# EAGLE design draft2 (EAGLE 7.6.0)

## Sheet 1 of 2
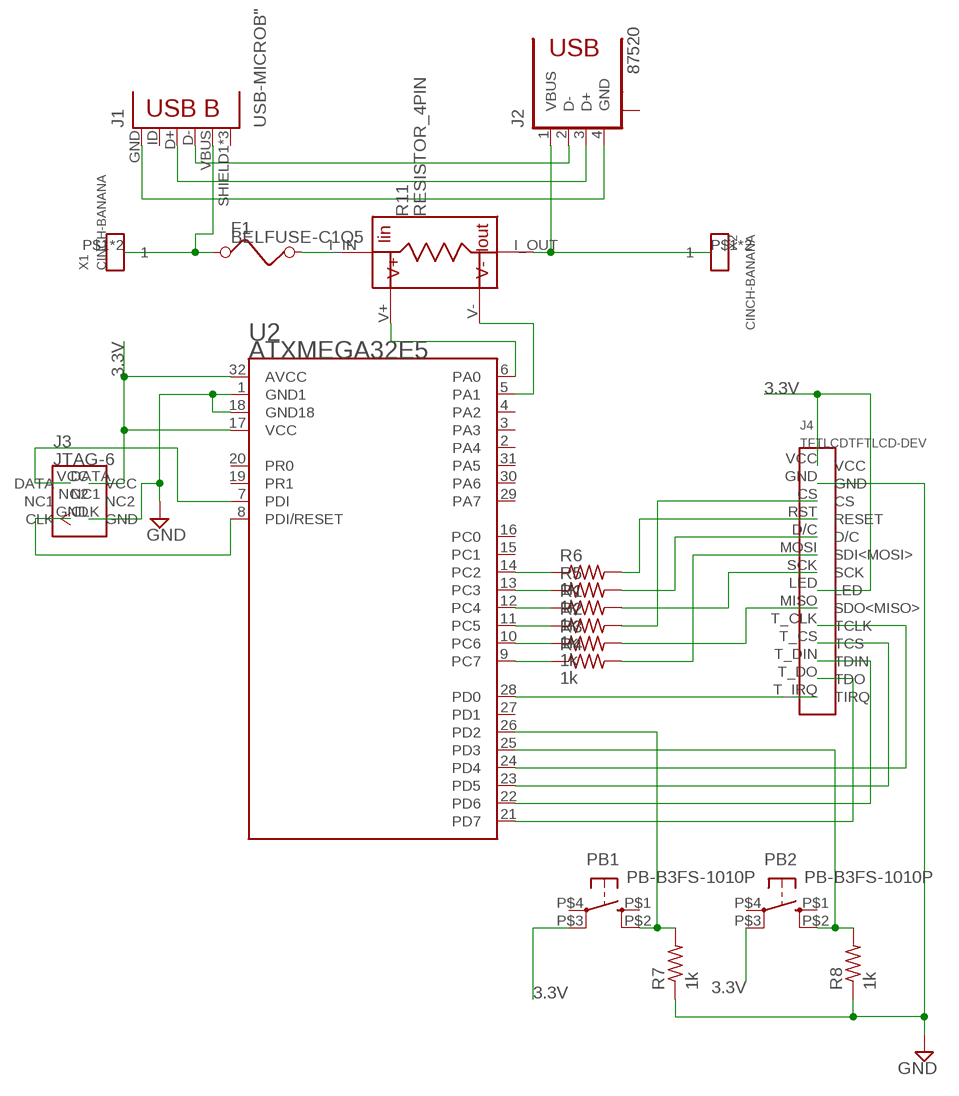
[diagram p0: schematic, sheet 1]

### Parts
ATXMEGA32E5  U2  ATXMEGA32E5/16E5/8E5ATXMEGA32E5-AU  [TQFP32-08]
F1  BELFUSE-C1Q5  [BELFUSE-C1Q5]
J1  USB-MICROB"  [USB-B-MICRO-SMD_V03]
J2  87520  [87520]
J3  JTAG-6  [JTAG6]
J4  TFTLCDTFTLCD-DEV  [TFTLCD]
PB1  PB-B3FS-1010P  [PB-B3FS-1010P]
PB2  PB-B3FS-1010P  [PB-B3FS-1010P]
R1  1k  R-RC1206  [RC1206]
R2  1k  R-RC1206  [RC1206]
R3  1k  R-RC1206  [RC1206]
R4  1k  R-RC1206  [RC1206]
R5  1k  R-RC1206  [RC1206]
R6  1k  R-RC1206  [RC1206]
R7  1k  R-RC1206  [RC1206]
R8  1k  R-RC1206  [RC1206]
R11  RESISTOR_4PIN  [RESISTOR_4PIN]
X1  CINCH-BANANA  [CINCH-BANANA]
X2  CINCH-BANANA  [CINCH-BANANA]

### Nets
3.3V: ATXMEGA32E5.17(VCC) ATXMEGA32E5.32(AVCC) J3.VCC J4.LED J4.VCC PB1.P$3(SW3) PB2.P$3(SW3) ; also sheet 2
GND: ATXMEGA32E5.1(GND1) ATXMEGA32E5.18(GND18) J3.GND J4.GND R7.P$1 R8.P$1 ; also sheet 2
N$1: ATXMEGA32E5.7(PDI) J3.DATA
N$2: ATXMEGA32E5.8(PDI/RESET) J3.CLK
N$3: ATXMEGA32E5.9(PC7) R4.P$1
N$4: ATXMEGA32E5.10(PC6) R3.P$1
N$5: ATXMEGA32E5.11(PC5) R2.P$1
N$6: ATXMEGA32E5.12(PC4) R1.P$1
N$7: J4.MOSI(SDI<MOSI>) R4.P$2
N$8: J4.MISO(SDO<MISO>) R3.P$2
N$9: J4.SCK R1.P$2
N$10: J4.CS R2.P$2
N$11: ATXMEGA32E5.14(PC2) R6.P$1
N$12: J4.RST(RESET) R6.P$2
N$13: ATXMEGA32E5.13(PC3) R5.P$1
N$14: J4.D/C R5.P$2
N$15: ATXMEGA32E5.28(PD0) J4.T_IRQ(TIRQ)
N$16: ATXMEGA32E5.21(PD7) J4.T_DO(TDO)
N$17: ATXMEGA32E5.22(PD6) J4.T_DIN(TDIN)
N$18: ATXMEGA32E5.23(PD5) J4.T_CS(TCS)
N$19: ATXMEGA32E5.24(PD4) J4.T_CLK(TCLK)
N$20: ATXMEGA32E5.26(PD2) PB1.P$2(SW2) R7.P$2
N$21: ATXMEGA32E5.25(PD3) PB2.P$2(SW2) R8.P$2
N$22: ATXMEGA32E5.6(PA0) R11.V+
N$23: ATXMEGA32E5.5(PA1) R11.V-
N$24: F1.P$1 J1.VBUS X1.P$1 X1.P$2
N$25: F1.P$2 R11.I_IN
N$26: J1.GND J2.4(GND)
N$28: J1.D+ J2.3(D+)
N$29: J1.D- J2.2(D-)
N$30: J2.1(VBUS) R11.I_OUT X2.P$1 X2.P$2
Unconnected: ATXMEGA32E5.2(PA4) ATXMEGA32E5.3(PA3) ATXMEGA32E5.4(PA2) ATXMEGA32E5.15(PC1) ATXMEGA32E5.16(PC0) ATXMEGA32E5.19(PR1) ATXMEGA32E5.20(PR0) ATXMEGA32E5.27(PD1) ATXMEGA32E5.29(PA7) ATXMEGA32E5.30(PA6) ATXMEGA32E5.31(PA5) J1.ID(USBID) J1.SHIELD1(SHIELD) J1.SHIELD2(SHIELD) J1.SHIELD3(SHIELD) J2.S1 J2.S2 J3.NC1 J3.NC2 PB1.P$1(SW1) PB1.P$4(SW4) PB2.P$1(SW1) PB2.P$4(SW4)

## Sheet 2 of 2
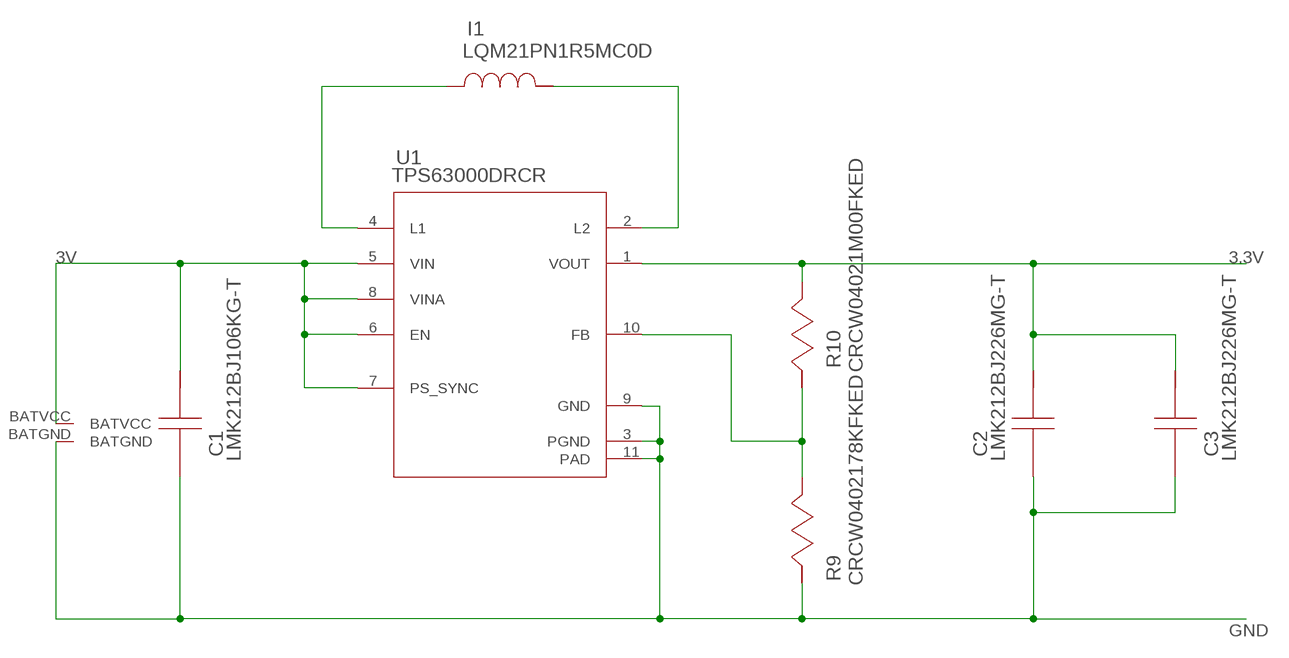
[diagram p1: schematic, sheet 2]

### Parts
C1  LMK212BJ106KG-T  [0805]
C2  LMK212BJ226MG-T  [0805]
C3  LMK212BJ226MG-T  [0805]
I1  LQM21PN1R5MC0D  [0805]
R9  CRCW0402178KFKED  [0402]
R10  CRCW04021M00FKED  [0402]
U1  TPS63000DRCR  [DRC0010J]
U$12  BATTERYHOLDER  [BATTERYHOLDER]

### Nets
3.3V: C2.1 C3.1 R10.1 U1.1(VOUT) ; also sheet 1
3V: C1.1 U1.5(VIN) U1.6(EN) U1.7(PS_SYNC) U1.8(VINA) U$12.BATVCC
GND: C1.2 C2.2 C3.2 R9.2 U1.3(PGND) U1.9(GND) U1.11(PAD) U$12.BATGND ; also sheet 1
N$31: I1.1 U1.4(L1)
N$32: I1.2 U1.2(L2)
N$34: R9.1 R10.2 U1.10(FB)

## Library data of the parts
ATXMEGA32E5 = ese323:ATXMEGA32E5/16E5/8E5: 8/16-bit Atmel AVR XMEGA Microcontrollers
C1 = 00ese323:LMK212BJ106KG-T; MANUFACTURER_NAME: Taiyo Yuden; VENDOR: Taiyo Yuden
C2 C3 = 00ese323:LMK212BJ226MG-T; MANUFACTURER_NAME: Taiyo Yuden; VENDOR: Taiyo Yuden
F1 = 00ese323:BELFUSE-C1Q5
I1 = 00ese323:LQM21PN1R5MC0D; MANUFACTURER_NAME: MuRata; VENDOR: MuRata
J1 = 00ese323:USB-MICROB; PROD_ID: CONN-11752
J2 = 00ese323:87520: TYPE-A Receptacle, FCI
J3 = 00ese323:JTAG-6
J4 = 00ese323:TFTLCD
PB1 PB2 = 00ese323:PB-B3FS-1010P
R1-R8 = 00ese323:R-RC1206
R9 = 00ese323:CRCW0402178KFKED; MANUFACTURER_NAME: Vishay-Dale; VENDOR: Vishay-Dale
R10 = 00ese323:CRCW04021M00FKED; MANUFACTURER_NAME: Vishay-Dale; VENDOR: Vishay-Dale
R11 = 00ese323:RESISTOR_4PIN
U1 = 00ese323:TPS63000DRCR; MANUFACTURER_NAME: Texas Instruments; MANUFACTURER_PART_NUMBER: TPS63000DRCR
U$12 = 00ese323:BATTERYHOLDER
X1 X2 = 00ese323:CINCH-BANANA

## Board
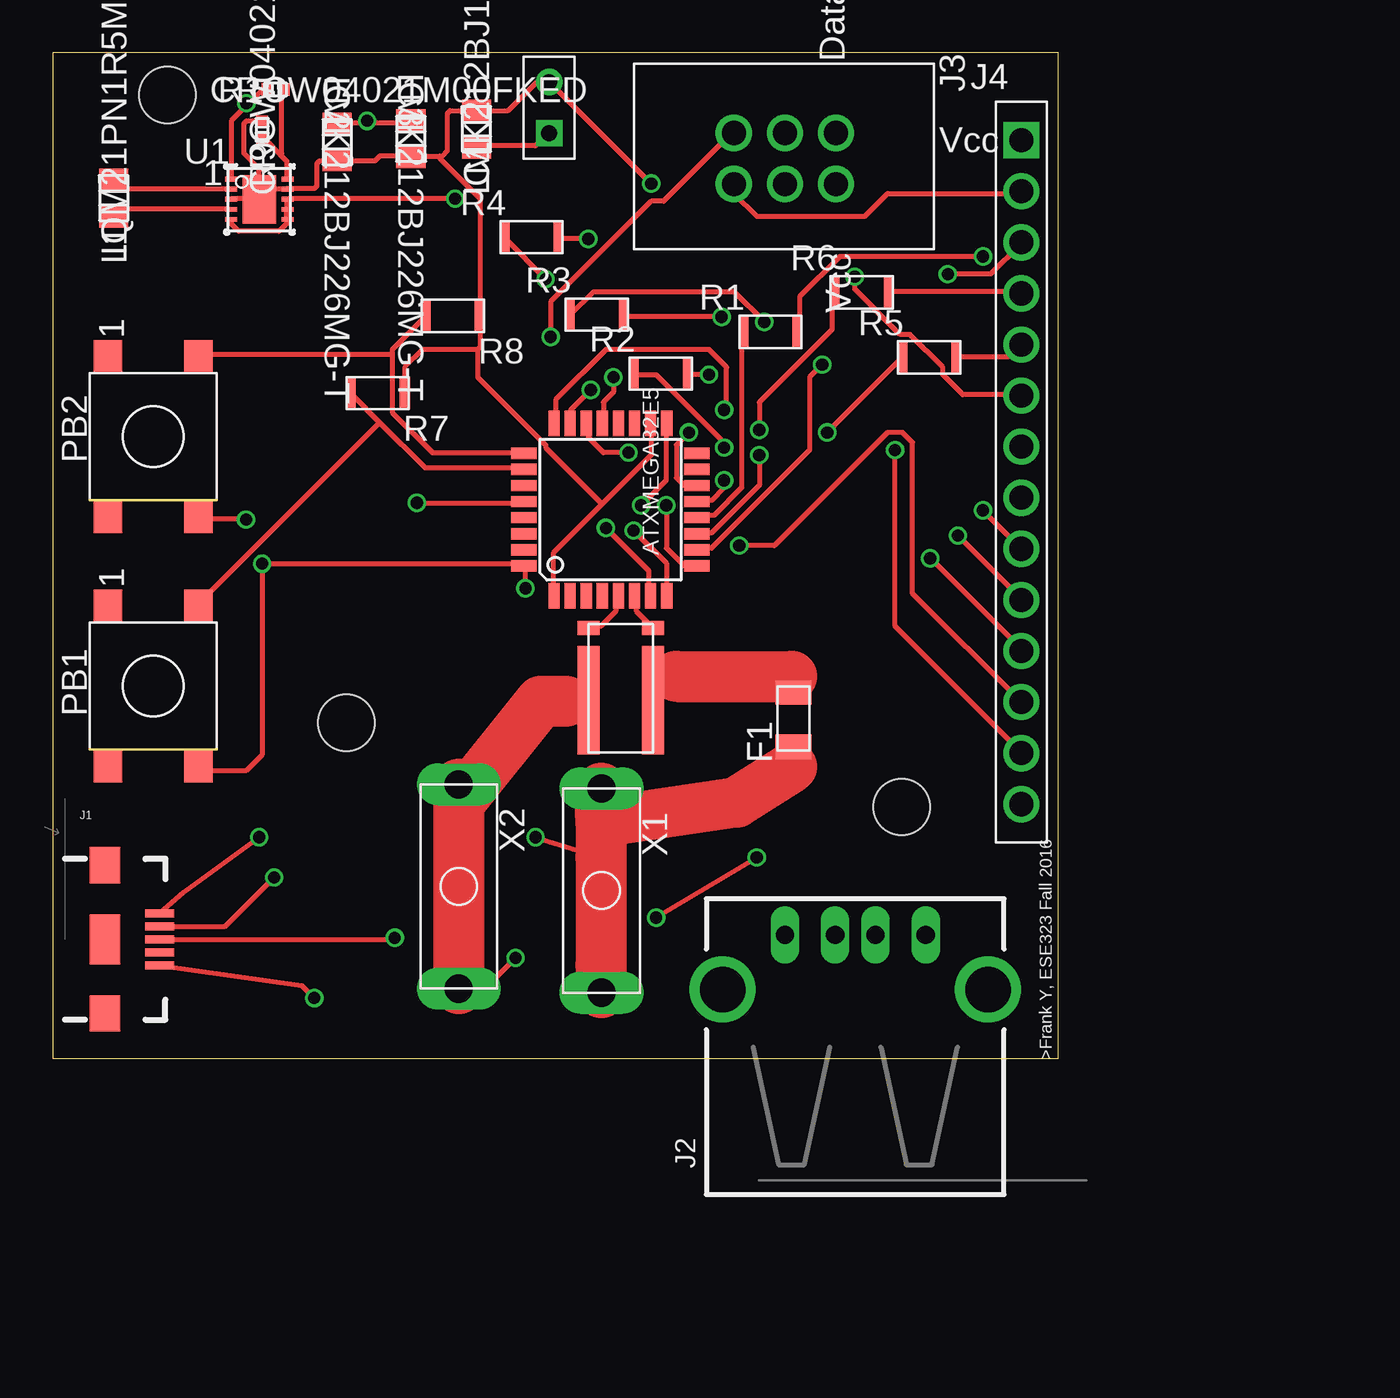
[diagram p2: board, top side]
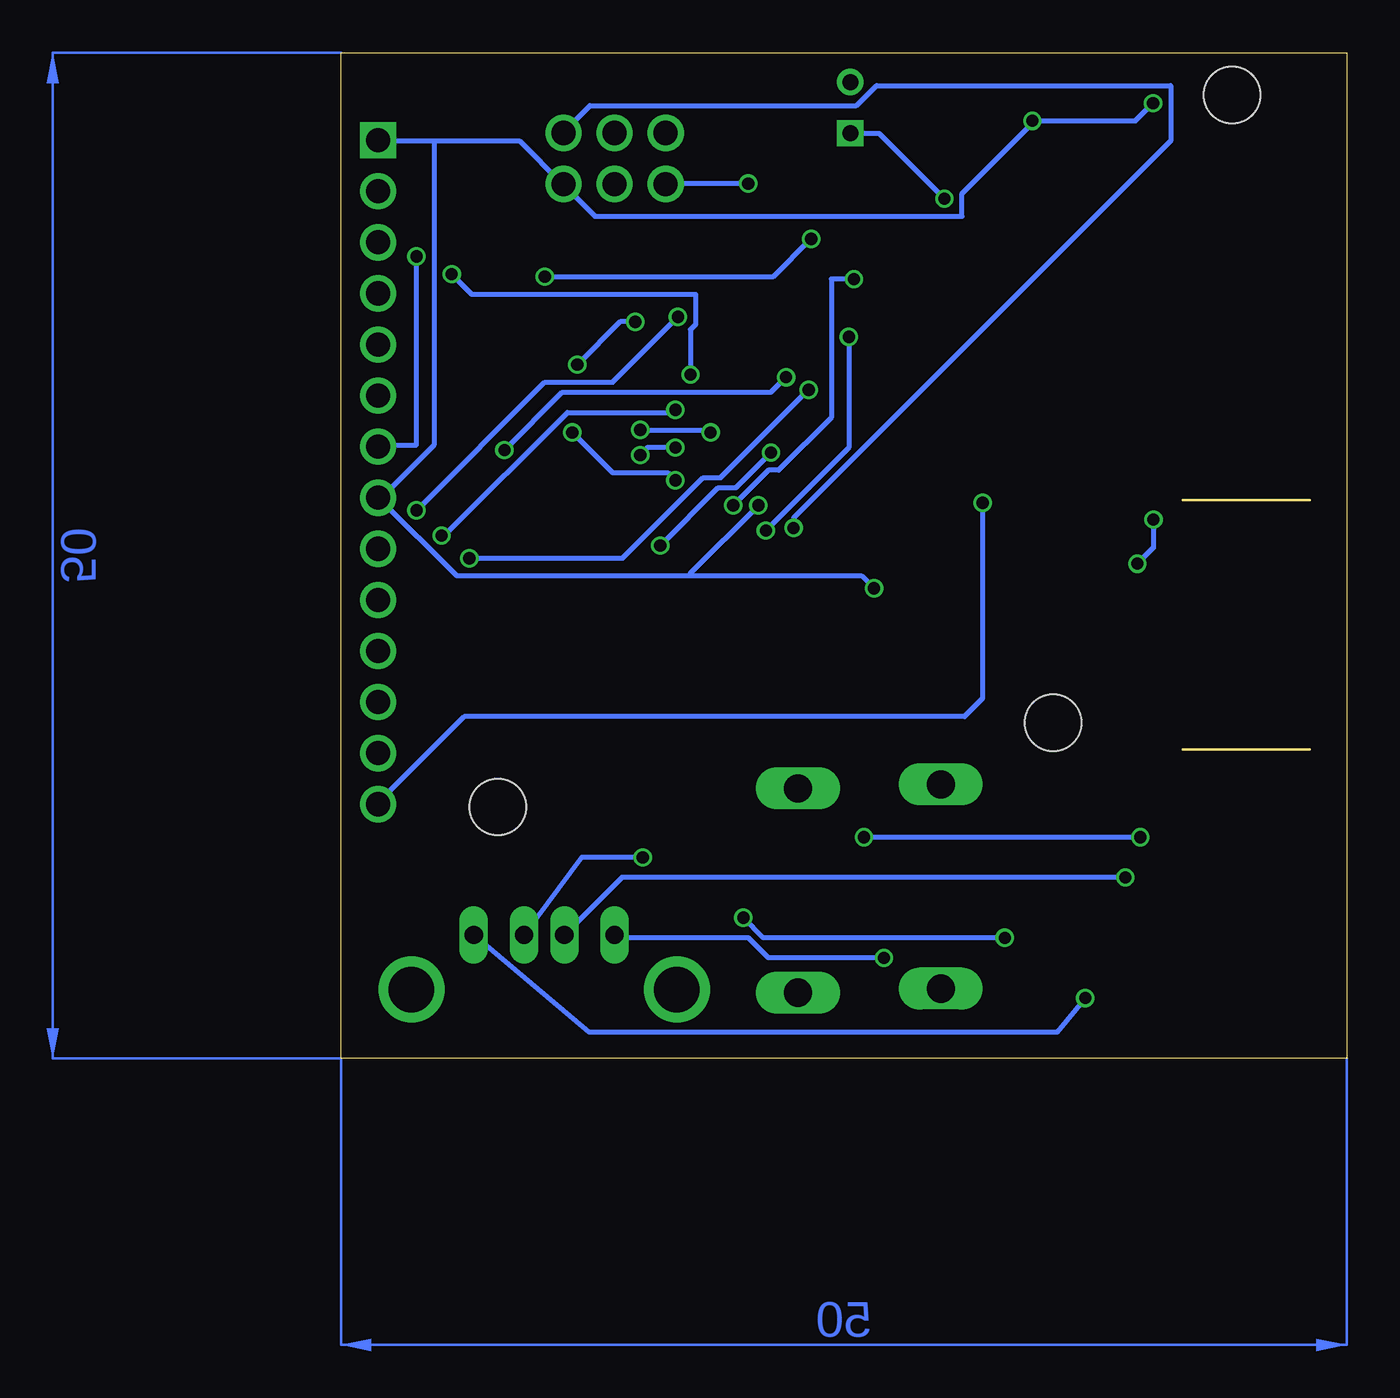
[diagram p3: board, bottom side, seen from below]

Size 50 x 50 mm. Coordinates in mm from the lower left corner, seen from the top.
Outline: 0,0 50,0 50,50 0,50 0,0
Copper layers (1*16): Top 0.035mm / dielectric 1.5mm / Bottom 0.035mm
Design rules "SeeedStudio_2layer_DRU_no_angle_20140221": minimum track width 6mil, minimum drill 12mil, track to track 6mil, track to pad 6mil, pad to pad 6mil, via to via 6mil, smd to smd 0mil, copper to edge 10mil, drill to drill 10mil, minimum pad ring 10mil, minimum via ring 6mil, stop-mask expansion 2mil, vias tented up to drill 100mil, thermal gap 10mil
Holes 2.8 mm at 5.7,47.9 42.2,12.5 14.6,16.7

### Footprints (pad centres in the part's own frame; a part is rotated, then mirrored left to right if it is on the bottom)
TQFP32-08 = smd 1.27 x 0.559: 1 -4.293,2.8; 2 -4.293,2; 3 -4.293,1.2; 4 -4.293,0.4; 5 -4.293,-0.4; 6 -4.293,-1.2; 7 -4.293,-2; 8 -4.293,-2.8; 17 4.293,-2.8; 18 4.293,-2; 19 4.293,-1.2; 20 4.293,-0.4; 21 4.293,0.4; 22 4.293,1.2; 23 4.293,2; 24 4.293,2.8 | smd 0.559 x 1.27: 9 -2.8,-4.293; 10 -2,-4.293; 11 -1.2,-4.293; 12 -0.4,-4.293; 13 0.4,-4.293; 14 1.2,-4.293; 15 2,-4.293; 16 2.8,-4.293; 25 2.8,4.293; 26 2,4.293; 27 1.2,4.293; 28 0.4,4.293; 29 -0.4,4.293; 30 -1.2,4.293; 31 -2,4.293; 32 -2.8,4.293
0805 = smd 1.118 x 1.448: 1 -0.902,0; 2 0.902,0
BELFUSE-C1Q5 = smd 1.2 x 1.8: P$1 0.2,-0.8; P$2 2.9,-0.8
USB-B-MICRO-SMD_V03 = smd 1.45 x 0.4: D+ 2.725,0; D- 2.725,0.65; GND 2.725,-1.3; ID 2.725,-0.65; VBUS 2.725,1.3 | smd 1.5 x 1.8: SHIELD1 0,3.685; SHIELD2 0,-3.685 | smd 1.5 x 2.5: SHIELD3 0,0
87520 = drill 0.914 long: 1 -3.5,2.71; 2 -1,2.71; 3 1,2.71; 4 3.5,2.71 | drill 2.261: S1 -6.6,0; S2 6.6,0
JTAG6 = drill 1.2: CLK -1.27,-6.14; DATA -1.27,-1.06; GND 1.27,-6.14; NC1 -1.27,-3.6; NC2 1.27,-3.6; VCC 1.27,-1.06
TFTLCD = drill 1.2: CS 0,7.62; D/C 0,2.54; GND 0,10.16; LED 0,-5.08; MISO 0,-7.62; MOSI 0,0; RST 0,5.08; SCK 0,-2.54; T_CLK 0,-10.16; T_CS 0,-12.7; T_DIN 0,-15.24; T_DO 0,-17.78; T_IRQ 0,-20.32 | drill 1.2 square: VCC 0,12.7
PB-B3FS-1010P = smd 1.6 x 1.4: P$1 4,2.25; P$2 4,-2.25; P$3 -4,-2.25; P$4 -4,2.25
RC1206 = smd 0.5 x 1.6: P$1 -1.4,0; P$2 1.3,0
0402 = smd 0.559 x 0.61: 1 -0.419,0; 2 0.419,0
RESISTOR_4PIN = smd 1.1 x 5.4: I_IN 1.6,-0.2; I_OUT -1.6,-0.2 | smd 1.1 x 0.7: V+ 1.6,3.4; V- -1.6,3.4
DRC0010J = smd 0.6 x 0.24: 1 -1.4,1; 2 -1.4,0.5; 3 -1.4,0; 4 -1.4,-0.5; 5 -1.4,-1; 6 1.4,-1; 7 1.4,-0.5; 8 1.4,0; 9 1.4,0.5; 10 1.4,1 | smd 1.65 x 2.4: 11 0,0
BATTERYHOLDER = drill 0.8: BATGND 0,-1.27 | drill 0.8 square: BATVCC 0,1.27
CINCH-BANANA = drill 1.4 long: P$1 -5.08,0; P$2 5.08,0

### Placement (x,y rotation side)
ATXMEGA32E5  27.72,27.29 90 top
C1  21.06,46.21 90 top
C2  14.14,45.57 270 top
C3  17.8,45.73 270 top
F1  36.03,15.3 90 top
I1  3.03,42.78 90 top
J1  2.59,5.92 0 top
J2  39.9,3.43 0 top
J3  40,44.75 270 top
J4  48.16,32.96 0 top
PB1  4.99,18.52 90 top
PB2  4.99,30.92 90 top
R1  35.73,36.13 0 top
R2  30.27,34.05 0 top
R3  27.09,36.98 0 top
R4  23.85,40.83 0 top
R5  43.63,34.86 0 top
R6  40.27,38.09 0 top
R7  16.1,33.08 180 top
R8  19.83,36.92 180 top
R9  10.41,46.18 90 top
R10  11.07,48.18 0 top
R11  28.24,18.01 0 top
U1  10.27,42.72 0 top
U$12  24.68,47.28 180 top
X1  27.28,8.35 270 top
X2  20.18,8.55 270 top

### Tracks (layer width: path | path; a pad name or v marks a point on that pad's centre or on a via)
3.3V  (via drill 0.6, 0.61)
  Top 0.254: v23.5,23.38 23.5,24.38 ATXMEGA32E5.32 23.32,24.6 v10.4,24.6 10.4,15.1 9.6,14.3 7.46,14.3 PB1.P$3 | v29.25,27.5 30.5,28.75 30.5,31.5 ATXMEGA32E5.17 | 9.69,47.44 10.38,48.12 10.62,48.12 R10.1 | 9.69,47.44 8.88,46.62 8.88,43.75 U1.1 | 15.62,46.5 17.62,46.5 17.75,46.62 C3.1 | 15.62,46.5 14.25,46.5 C2.1 | v9.62,47.5 9.69,47.44 | v15.62,46.62 15.62,46.5 | PB2.P$3 7.24,26.84 9.56,26.84 v9.6,26.8
  Bottom 0.254: v23.5,23.38 24.12,24 32.62,24 | 32.62,24 44.25,24 48.12,27.88 J4.LED 48,27.88 45.38,30.5 45.38,45.62 | v29.25,27.5 32.62,24.12 32.62,24 | v9.62,47.5 10.5,46.62 v15.62,46.62 15.62,46.5 19.12,43 19.12,41.88 37.38,41.88 38.88,43.38 J3.VCC 39,43.5 41.12,45.62 45.38,45.62 | 45.38,45.62 48.12,45.62 J4.VCC | v9.6,26.8 9.6,25.4 v10.4,24.6
3V  (via drill 0.61)
  Top 0.254: U1.5 8.88,41.62 8.88,41.5 9.25,41.12 11.25,41.12 11.75,41.62 U1.6 11.62,41.75 11.62,42.12 U1.7 11.62,42.25 11.62,42.62 U1.8 11.75,42.75 v20,42.75 | C1.1 21.12,45.38 24,45.38 24.62,46 U$12.BATVCC
  Bottom 0.254: v20,42.75 23.25,46 24.62,46 U$12.BATVCC
GND  (via drill 0.61)
  Top 0.254: 27.31,27.56 29.75,30 29.75,31.5 ATXMEGA32E5.18 | 27.31,27.56 24.88,25.12 24.88,23 ATXMEGA32E5.1 | R7.P$1 17.5,34.38 18.38,35.25 21.12,35.25 | 21.12,35.25 21.25,35.38 21.25,36.88 R8.P$1 21.25,37 21.25,42.75 19.25,44.75 19.25,44.88 | U1.3 8.88,42.75 10.12,42.75 10.25,42.88 10.38,42.75 U1.11 | U1.11 10.25,43 10.25,43.25 11.62,43.25 U1.9 11.75,43.25 13,43.25 13.12,43.38 13.12,44.5 13.25,44.62 14.12,44.62 C2.2 14.25,44.62 16,44.62 16.25,44.88 17.75,44.88 C3.2 17.88,44.88 19.25,44.88 | R9.2 10.38,46.62 9.62,46.62 9.5,46.5 9.5,45 10.25,44.25 10.25,43.38 U1.11 | 19.25,44.88 19.38,44.88 19.62,45.12 19.62,47 19.75,47.12 21,47.12 C1.2 21.12,47.12 22.62,47.12 24,48.5 24.62,48.5 U$12.BATGND 24.75,48.5 v29.75,43.5 | J4.GND 48.12,43 41.5,43 40.38,41.88 35,41.88 33.88,43 33.88,43.38 J3.GND | 27.31,27.56 24.5,30.38 24.5,30.5 21.12,33.88 21.12,35.25
  Bottom 0.254: v29.75,43.5 33.75,43.5 J3.GND
N$1  (via drill 0.61)
  Top 0.254: v27.5,26.38 29.62,24.25 29.62,23 ATXMEGA32E5.7
  Bottom 0.254: v27.5,26.38 27.5,26.88 8.75,45.62 8.75,48.38 23.38,48.38 24.38,47.38 37.62,47.38 38.88,46.12 J3.DATA
N$2  (via drill 0.61)
  Top 0.254: v28.88,26.25 30.5,24.62 30.5,23 ATXMEGA32E5.8 | v24.75,35.88 24.75,37.62 29.75,42.62 30.38,42.62 33.75,46 J3.CLK
  Bottom 0.254: v28.88,26.25 24.75,30.38 v24.75,35.88
N$3  (via drill 0.61)
  Top 0.254: v30.5,27.5 30.5,25.38 31.38,24.5 ATXMEGA32E5.9 | v24.5,38.75 22.5,40.75 R4.P$1
  Bottom 0.254: v30.5,27.5 28.75,29.25 28.25,29.25 25.62,31.88 25.62,38.75 v24.5,38.75
N$4  (via drill 0.61)
  Top 0.254: v38.25,34.5 37.62,33.88 37.62,30.25 32.75,25.38 32.12,25.38 ATXMEGA32E5.10 | v35.38,36.62 33.88,38.12 26.88,38.12 25.75,37 R3.P$1
  Bottom 0.254: v38.25,34.5 36.12,36.62 v35.38,36.62
N$5  (via drill 0.61)
  Top 0.254: v35.12,30 35.12,28.5 32.75,26.12 32.12,26.12 ATXMEGA32E5.11 | v33.38,30.38 33.38,30.62 30,34 28.88,34 R2.P$1
  Bottom 0.254: v35.12,30 34.75,30.38 v33.38,30.38
N$6
  Top 0.254: ATXMEGA32E5.12 32.12,27 32.88,27 34.25,28.38 34.25,36.12 R1.P$1
N$7  (via drill 0.61)
  Top 0.254: v26.62,40.75 25.25,40.75 R4.P$2 | v39.88,38.88 39.88,38.25 42.12,36 42.62,36 44.25,34.38 44.25,34 45.25,33 48.12,33 J4.MOSI
  Bottom 0.254: v26.62,40.75 28.5,38.88 v39.88,38.88
N$8  (via drill 0.61)
  Top 0.254: v33.25,36.88 28.5,36.88 R3.P$2 | J4.MISO v46.25,27.25
  Bottom 0.254: v33.25,36.88 36.5,33.62 39.88,33.62 v46.25,27.25
N$9  (via drill 0.61)
  Top 0.254: v46.25,39.88 39.12,39.88 37.12,37.88 37.12,36.25 R1.P$2
  Bottom 0.254: v46.25,39.88 46.25,30.5 48.12,30.5 J4.SCK
N$10  (via drill 0.61)
  Top 0.254: v32.62,34 31.62,34 R2.P$2 | v44.5,39 46.62,39 48.12,40.5 J4.CS
  Bottom 0.254: v32.62,34 32.62,36.25 32.38,36.5 32.38,38 43.5,38 v44.5,39
N$11  (via drill 0.61)
  Top 0.254: v31.62,31.12 31,30.5 31,28.88 31.38,28.5 ATXMEGA32E5.14 | v35.12,31.25 35.12,32.62 38.75,36.25 38.75,38 R6.P$1
  Bottom 0.254: v31.62,31.12 31.75,31.25 v35.12,31.25
N$12
  Top 0.254: R6.P$2 41.62,38.12 48.12,38.12 J4.RST
N$13  (via drill 0.61)
  Top 0.254: v33.38,28.75 33.38,28.38 32.75,27.75 32.12,27.75 ATXMEGA32E5.13 | v38.5,31.12 42.12,34.75 R5.P$1
  Bottom 0.254: v33.38,28.75 33.75,29.12 36.5,29.12 v38.5,31.12
N$14
  Top 0.254: R5.P$2 45,34.88 47.5,34.88 48.12,35.5 J4.D/C
N$15  (via drill 0.61)
  Top 0.254: v18.1,27.62 23.38,27.62 ATXMEGA32E5.28
  Bottom 0.254: J4.T_IRQ 48.12,12.75 43.88,17 19,17 18.1,17.9 v18.1,27.62
N$16  (via drill 0.61)
  Top 0.254: v27.88,33.88 27.88,33.12 27.38,32.62 27.38,31.62 ATXMEGA32E5.21 | v41.88,30.25 41.88,21.5 48.12,15.25 J4.T_DO
  Bottom 0.254: v27.88,33.88 28.62,33.12 39,33.12 v41.88,30.25
N$17  (via drill 0.61)
  Top 0.254: v28.62,30.12 27.38,30.12 26.62,30.88 26.62,31.5 ATXMEGA32E5.22 | v34.12,25.5 35.88,25.5 41.5,31.12 42.25,31.12 42.75,30.62 42.75,23.12 48.12,17.75 J4.T_DIN
  Bottom 0.254: v28.62,30.12 30.38,28.38 31.25,28.38 v34.12,25.5
N$18  (via drill 0.61)
  Top 0.254: v26.75,33.25 25.75,32.25 25.75,31.62 ATXMEGA32E5.23 | v43.62,24.88 48.12,20.38 J4.T_CS
  Bottom 0.254: v26.75,33.25 31.12,28.88 32,28.88 36,24.88 v43.62,24.88
N$19  (via drill 0.61)
  Top 0.254: v33.38,32.25 33.5,32.38 33.5,34.38 32.62,35.25 27.5,35.25 25,32.75 25,31.62 ATXMEGA32E5.24 | v45,26 48.12,22.88 J4.T_CLK
  Bottom 0.254: v33.38,32.25 33.5,32.12 38.75,32.12 44.88,26 v45,26
N$20
  Top 0.254: 16.25,31.62 14.88,33 R7.P$2 | 16.25,31.62 18.5,29.38 23.38,29.38 ATXMEGA32E5.26 | 16.25,31.62 7.25,22.62 PB1.P$2
N$21
  Top 0.254: 16.88,35 16.88,35.25 18.5,36.88 R8.P$2 | 16.88,35 16.88,32.12 18.88,30.12 23.38,30.12 ATXMEGA32E5.25 | 16.88,35 7.25,35 PB2.P$2
N$22
  Top 0.254: R11.V+ 29,22.25 29,22.88 ATXMEGA32E5.6
N$23
  Top 0.254: R11.V- 26.75,21.5 27.25,21.5 28,22.25 28,22.88 ATXMEGA32E5.5
N$24  (via drill 0.6)
  Top 0.254: v10.25,11 6.5,8.25 J1.VBUS | 36.75,14.5 F1.P$1 | v24,11 27.25,10
  Top 2.54: 36.75,14.5 34,12.75 27.25,11.75 | 27.25,11.75 27.25,10 27.25,4.64 X1.P$2 | 27.25,11.75 27.2,12.75 X1.P$1
  Bottom 0.254: v10.25,11 v24,11
N$25
  Top 0.254: 29.75,17.88 R11.I_IN 31,19 | 36.75,19 F1.P$2
  Top 2.54: 31,19 36.75,19
N$26  (via drill 0.6)
  Top 0.254: J1.GND 12.38,3.62 v13,3
  Bottom 0.254: J2.4 37.66,1.3 14.4,1.3 v13,3
N$28  (via drill 0.6)
  Top 0.254: v30,7 v35,10 | J1.D+ 16.92,5.92 v17,6
  Bottom 0.254: v17,6 29,6 v30,7 | v35,10 38.04,10 J2.3
N$29  (via drill 0.6)
  Top 0.254: J1.D- 8.57,6.57 v11,9
  Bottom 0.254: v11,9 36.04,9 J2.2
N$30  (via drill 0.6)
  Top 0.254: 20.25,12.75 X2.P$1 | 25.5,17.75 R11.I_OUT | X2.P$2 20.47,2.47 v23,5
  Top 2.54: 20.25,12.75 24.25,17.75 25.5,17.75 | X2.P$1 X2.P$2
  Bottom 0.254: J2.1 36.25,6 29.75,6 28.75,5 v23,5
N$31
  Top 0.254: U1.4 8.75,42.25 3.38,42.25 3.12,42 I1.1
N$32
  Top 0.254: U1.2 8.75,43.25 3.5,43.25 3.12,43.62 I1.2
N$34
  Top 0.254: 11.31,44.94 10.5,45.75 R9.1 | 11.31,44.94 11.62,44.62 11.62,43.75 U1.10 | R10.2 11.38,48.12 11.38,45 11.31,44.94
(copper drawn outside any net)
  shapes: Bottom area x2

### Text on the board
tSilk: >Frank Y, ESE323 Fall 2016